# Altium schematic sheet Schematic_Main_Board.SchDoc
size A3
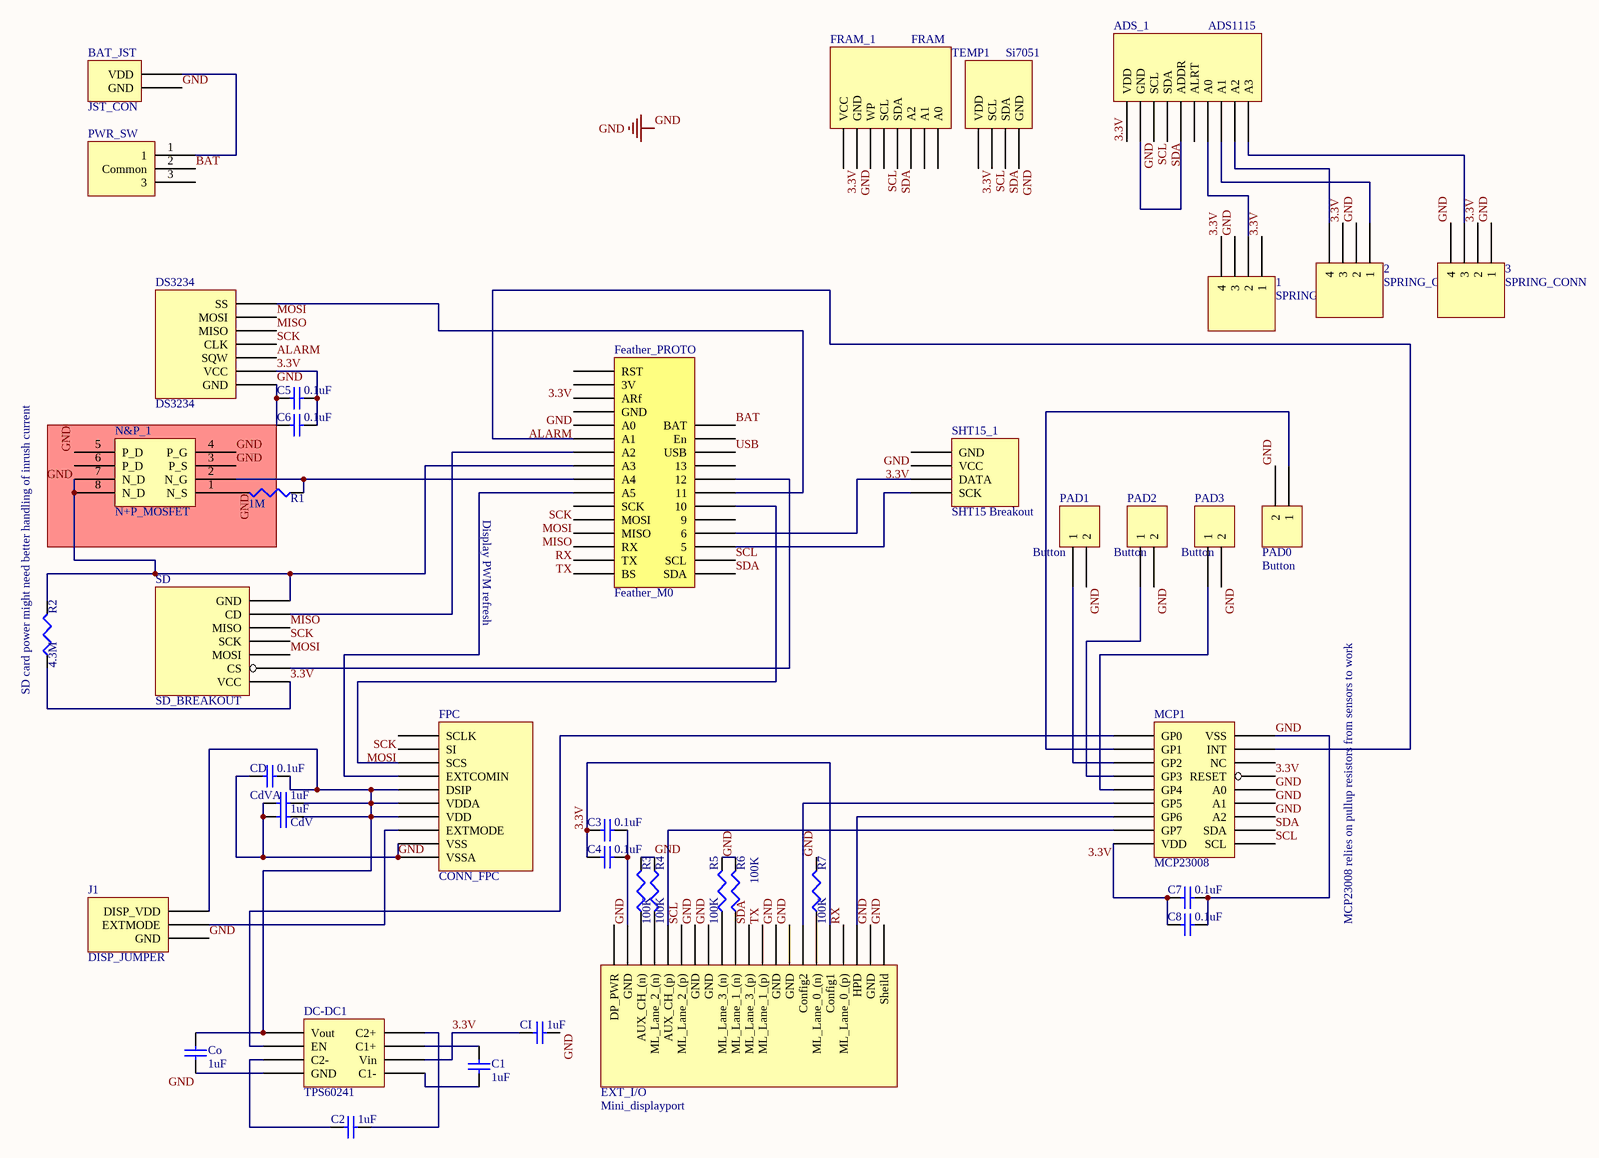
[diagram p0: Schematic_Main_Board.SchDoc]

## Parts
1  SPRING_CONN  [QUICK_CONN]
2  SPRING_CONN  [QUICK_CONN]
3  SPRING_CONN  [QUICK_CONN]
ADS_1  ADS1115  [ADS1115]
BAT_JST  JST_CON  [JST_CONN]
C1  value 1uF  [C0805]  (hidden comment: Cap Semi)
C2  value 1uF  [C0805]  (hidden comment: Cap Semi)
C3  value 0.1uF  [C0805]  (hidden comment: Cap Semi)
C4  value 0.1uF  [C0805]  (hidden comment: Cap Semi)
C5  value 0.1uF  [C0805]  (hidden comment: Cap Semi)
C6  value 0.1uF  [C0805]  (hidden comment: Cap Semi)
C7  value 0.1uF  [C0805]  (hidden comment: Cap Semi)
C8  value 0.1uF  [C0805]  (hidden comment: Cap Semi)
CD  value 0.1uF  [C0805]  (hidden comment: Cap Semi)
CdV  value 1uF  [C0805]  (hidden comment: Cap Semi)
CdVA  value 1uF  [C0805]  (hidden comment: Cap Semi)
CI  value 1uF  [C0805]  (hidden comment: Cap Semi)
Co  value 1uF  [C0805]  (hidden comment: Cap Semi)
DC-DC1  TPS60241  [TPS60241]
DS3234  DS3234  [DS3234_FOOTPRINT]
EXT_I/O  Mini_displayport  [CONN_Displayport]
Feather_PROTO  Feather_M0  [Feather_M0]
FPC  CONN_FPC  [CONN_FPC]
FRAM_1  FRAM  [FRAM]
J1  DISP_JUMPER  [DISP_Jumper]
MCP1  MCP23008  [MCP23008]
N&P_1  N+P_MOSFET  [SOP8]
PAD0  Button  [Button_footprint]
PAD1  Button  [Button_footprint]
PAD2  Button  [Button_footprint]
PAD3  Button  [Button_footprint]
PWR_SW  Switch  [Switch_footprint]  (value not drawn)
R1  value 1M  [6-0805_N]  (hidden comment: Res3)
R2  value 4.3M  [6-0805_N]  (hidden comment: Res3)
R3  value 100K  [6-0805_N]  (hidden comment: Res3)
R4  value 100K  [6-0805_N]  (hidden comment: Res3)
R5  value 100K  [6-0805_N]  (hidden comment: Res3)
R6  value 100K  [6-0805_N]  (hidden comment: Res3)
R7  value 100K  [6-0805_N]  (hidden comment: Res3)
SD  SD_BREAKOUT  [SD_BREAKOUT_FOOTPRINT]
SHT15_1  SHT15 Breakout  [SHT15_BREAKOUT_FOOTPRINT]
TEMP1  Si7051  [Si7051_Footprint]

## Nets
GND: 1.3 2.2 3.1 3.4 ADS_1.2(GND) ADS_1.5(ADDR) BAT_JST.1(GND) C3.2 C4.1 C5.1 C6.2 C7.2 C8.1 CD.2 CdV.2 CdVA.2 CI.1 Co.2 DC-DC1.4(GND) DS3234.1(GND) EXT_I/O.0(Sheild) EXT_I/O.1(GND) EXT_I/O.7(GND) EXT_I/O.8(GND) EXT_I/O.13(GND) EXT_I/O.14(GND) EXT_I/O.19(GND) Feather_PROTO.4(GND) FPC.9(VSS) FPC.10(VSSA) FRAM_1.2(GND) J1.1(GND) MCP1.3(A2) MCP1.4(A1) MCP1.5(A0) MCP1.9(VSS) N&P_1.1(N_S) N&P_1.3(P_S) N&P_1.4(P_G) N&P_1.5(P_D) N&P_1.6(P_D) PAD0.2 PAD1.2 PAD2.2 PAD3.2 R1.2 R3.2 R4.1 R5.2 R6.2 R7.2 SHT15_1.1(GND) TEMP1.4(GND)
3.3V: 1.1 1.4 2.3 3.2 ADS_1.1(VDD) C3.1 C4.2 C5.2 C6.1 C7.1 C8.2 CI.2 DC-DC1.6(Vin) DS3234.2(VCC) EXT_I/O.4(Config1) Feather_PROTO.2(3V) FRAM_1.1(VCC) MCP1.6(RESET) MCP1.18(VDD) R2.1 SD.1(VCC) SHT15_1.2(VCC) TEMP1.1(VDD)
ALARM: DS3234.3(SQW) Feather_PROTO.5(A0)
BAT: Feather_PROTO.28(BAT) PWR_SW.2(Common)
MISO: DS3234.5(MISO) Feather_PROTO.13(MISO) SD.5(MISO)
MOSI: DS3234.6(MOSI) Feather_PROTO.12(MOSI) FPC.2(SI) SD.3(MOSI)
RX: EXT_I/O.3(ML_Lane_0_(p)) Feather_PROTO.14(RX)
SCK: DS3234.4(CLK) Feather_PROTO.11(SCK) FPC.1(SCLK) SD.4(SCK)
SCL: ADS_1.3(SCL) EXT_I/O.15(ML_Lane_2_(p)) Feather_PROTO.18(SCL) FRAM_1.4(SCL) MCP1.1(SCL) TEMP1.2(SCL)
SDA: ADS_1.4(SDA) EXT_I/O.10(ML_Lane_3_(p)) Feather_PROTO.17(SDA) FRAM_1.5(SDA) MCP1.2(SDA) TEMP1.3(SDA)
TX: EXT_I/O.9(ML_Lane_1_(p)) Feather_PROTO.15(TX)
USB: Feather_PROTO.26(USB)
Net1_2: 1.2 ADS_1.7(A0)
Net2_1: 2.1 ADS_1.8(A1)
Net2_4: 2.4 ADS_1.9(A2)
Net3_3: 3.3 ADS_1.10(A3)
NetBAT_JST_2: BAT_JST.2(VDD) PWR_SW.1
NetC1_1: C1.1 DC-DC1.7(C1+)
NetC1_2: C1.2 DC-DC1.5(C1-)
NetC2_1: C2.1 DC-DC1.8(C2+)
NetC2_2: C2.2 DC-DC1.3(C2-)
NetCD_1: CD.1 CdV.1 CdVA.1 Co.1 DC-DC1.1(Vout) FPC.5(DSIP) FPC.6(VDDA) FPC.7(VDD) J1.3(DISP_VDD)
NetDC-DC1_2: DC-DC1.2(EN) MCP1.10(GP0)
NetDS3234_7: DS3234.7(SS) Feather_PROTO.23(11)
NetEXT_I/O_2: EXT_I/O.2(HPD) MCP1.16(GP6)
NetEXT_I/O_5: EXT_I/O.5(ML_Lane_0_(n)) R7.1
NetEXT_I/O_6: EXT_I/O.6(Config2) MCP1.15(GP5)
NetEXT_I/O_11: EXT_I/O.11(ML_Lane_1_(n)) R6.1
NetEXT_I/O_12: EXT_I/O.12(ML_Lane_3_(n)) R5.1
NetEXT_I/O_16: EXT_I/O.16(AUX_CH_(p)) MCP1.17(GP7)
NetEXT_I/O_17: EXT_I/O.17(ML_Lane_2_(n)) R4.2
NetEXT_I/O_18: EXT_I/O.18(AUX_CH_(n)) R3.1
NetFeather_PROTO_6: Feather_PROTO.6(A1) MCP1.8(INT)
NetFeather_PROTO_7: Feather_PROTO.7(A2) SD.6(CD)
NetFeather_PROTO_8: Feather_PROTO.8(A3) N&P_1.7(N_D) N&P_1.8(N_D) R2.2 SD.7(GND)
NetFeather_PROTO_9: Feather_PROTO.9(A4) N&P_1.2(N_G) R1.1
NetFeather_PROTO_10: Feather_PROTO.10(A5) FPC.4(EXTCOMIN)
NetFeather_PROTO_19: Feather_PROTO.19(5) SHT15_1.4(SCK)
NetFeather_PROTO_20: Feather_PROTO.20(6) SHT15_1.3(DATA)
NetFeather_PROTO_22: Feather_PROTO.22(10) FPC.3(SCS)
NetFeather_PROTO_24: Feather_PROTO.24(12) SD.2(CS)
NetFPC_8: FPC.8(EXTMODE) J1.2(EXTMODE)
NetMCP1_11: MCP1.11(GP1) PAD0.1
NetMCP1_12: MCP1.12(GP2) PAD1.1
NetMCP1_13: MCP1.13(GP3) PAD2.1
NetMCP1_14: MCP1.14(GP4) PAD3.1

Not connected (* = marked no-connect by the designer): ADS_1 6(ALRT); EXT_I/O 20(DP_PWR); Feather_PROTO 1(RST) 3(ARf) 16(BS) 21(9) 25(13) 27(En); FRAM_1 3(WP) 6(A2) 7(A1) 8(A0); MCP1 7(NC); PWR_SW 3

## Notes on the sheet
- Display PWM refresh
- (near R2) SD card power might need better handling of inrush current
- MCP23008 relies on pullup resistors from sensors to work

## Library data of the parts
C1-C8 CD CdV CdVA CI Co = Cap Semi: Capacitor (Semiconductor SIM Model); Published: 8-Jun-2000; LatestRevisionDate: 29-May-2009; LatestRevisionNote: IPC-7351 Footprint Added.; PackageReference: C1206; Publisher: Altium Limited; PackageDescription: Chip Capacitor
R1-R7 = Res3: Resistor; Published: 8-Jun-2000; LatestRevisionDate: 29-May-2009; LatestRevisionNote: IPC-7351 Footprint Added.; PackageReference: J1-0603; Publisher: Altium Limited; PackageDescription: Chip Resistor
SHT15_1 = SHT15_BREAKOUT